# EAGLE design H1AR10 (EAGLE 9.5.1)

## Sheet 1 of 2
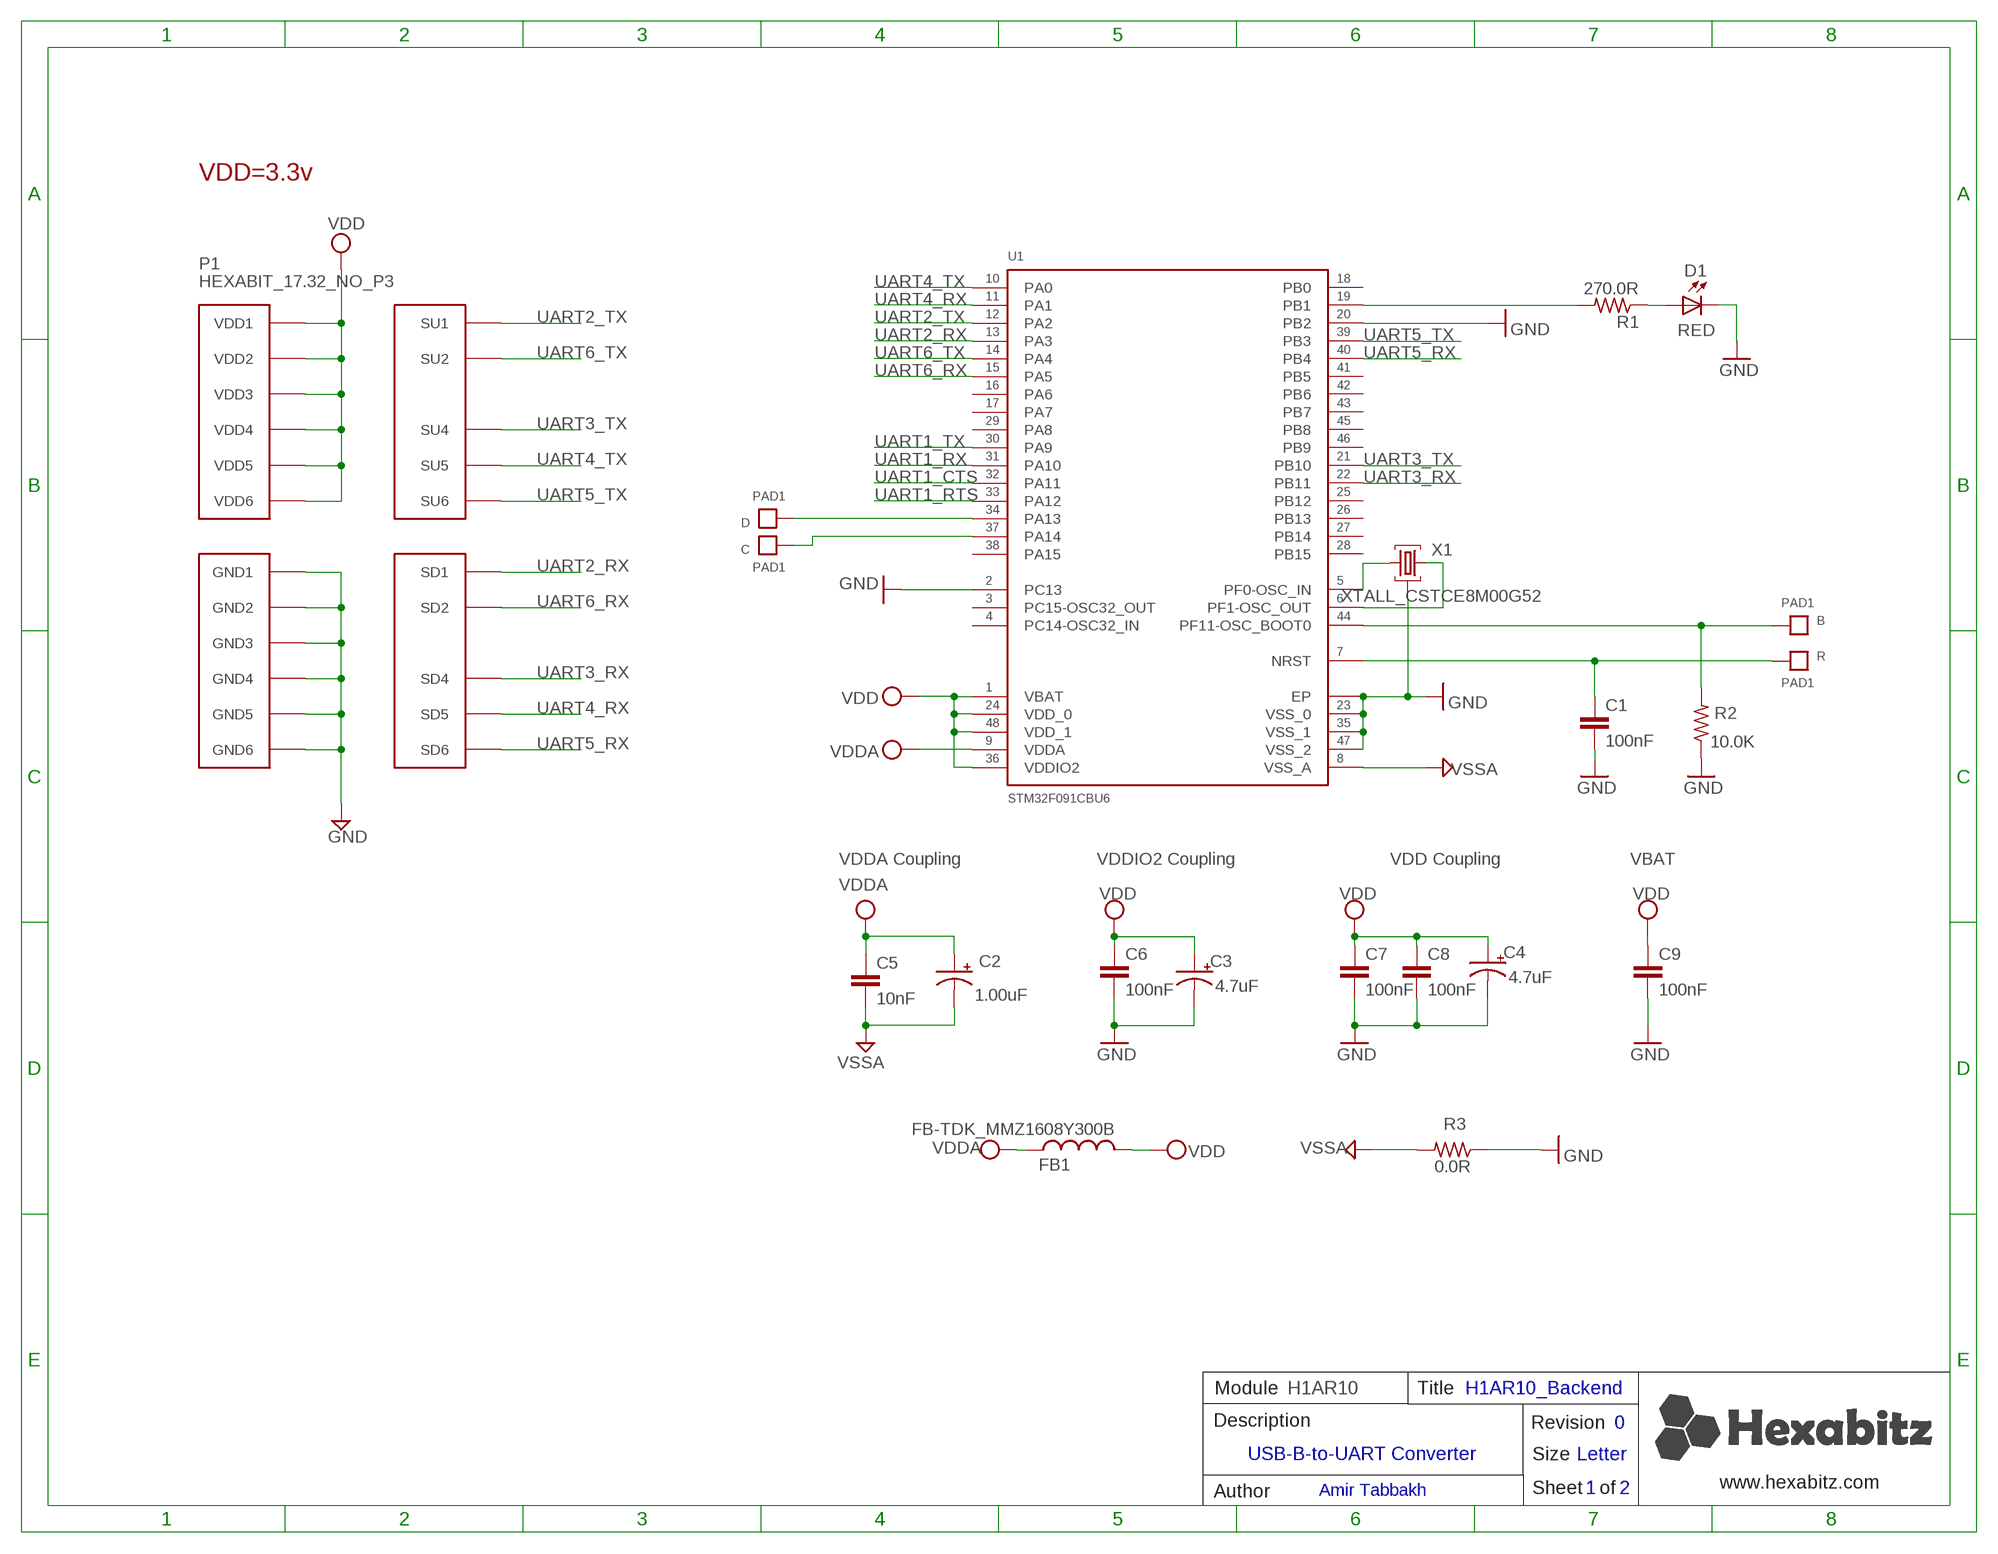
[diagram p0: schematic, sheet 1]

### Parts
B  PAD1  [PAD1]
C  PAD1  [PAD1]
C1  100nF  C-0603  [C-0603]
C2  1.00uF  C-0805-POL  [C-0805-POL]
C3  4.7uF  C-0805-POL  [C-0805-POL]
C4  4.7uF  C-0805-POL  [C-0805-POL]
C5  10nF  C-0603  [C-0603]
C6  100nF  C-0603  [C-0603]
C7  100nF  C-0603  [C-0603]
C8  100nF  C-0603  [C-0603]
C9  100nF  C-0603  [C-0603]
D  PAD1  [PAD1]
D1  RED  VLMS1300-GS08  [VLMS1300-GS08]
FB1  FB-TDK_MMZ1608Y300B  [FB-TDK_MMZ1608Y300B]
P1  HEXABIT_17.32_NO_P3  [HEXABIT_17.32_NO_P3]
R  PAD1  [PAD1]
R1  270.0R  R-0603  [R-0603]
R2  10.0K  R-0603  [R-0603]
R3  0.0R  R-0603  [R-0603]
U1  STM32F091CBU6  [STM32F091CBU6]
X1  XTALL_CSTCE8M00G52  [XTALL_CSTCE8M00G52]

### Nets
B1: B.P$1 B.P$2 R2.2 U1.P$44(PF11-OSC_BOOT0)
GND: C1.2 C3.2(-) C4.2(-) C6.2 C7.2 C8.2 C9.2 D1.C P1.PAD_PD7(GND1) P1.PAD_PD8(GND2) P1.PAD_PD9(GND3) P1.PAD_PD10(GND4) P1.PAD_PD11(GND5) P1.PAD_PD12(GND6) R2.1 R3.1 U1.EP U1.P$2(PC13) U1.P$20(PB2) U1.P$23(VSS_0) U1.P$35(VSS_1) U1.P$47(VSS_2) X1.P$2 ; also sheet 2
N$5: U1.P$5(PF0-OSC_IN) X1.P$1
N$6: U1.P$6(PF1-OSC_OUT) X1.P$3
N$7: D.P$1 D.P$2 U1.P$34(PA13)
N$9: C.P$1 C.P$2 U1.P$37(PA14)
N$18: D1.A R1.1
N$19: R1.2 U1.P$19(PB1)
R1: C1.1 R.P$1 R.P$2 U1.P$7(NRST)
UART1_CTS: U1.P$32(PA11) ; also sheet 2
UART1_RTS: U1.P$33(PA12) ; also sheet 2
UART1_RX: U1.P$31(PA10) ; also sheet 2
UART1_TX: U1.P$30(PA9) ; also sheet 2
UART2_RX: P1.PAD_PD1(SD1) U1.P$13(PA3)
UART2_TX: P1.PAD_PU1(SU1) U1.P$12(PA2)
UART3_RX: P1.PAD_PD4(SD4) U1.P$22(PB11)
UART3_TX: P1.PAD_PU4(SU4) U1.P$21(PB10)
UART4_RX: P1.PAD_PD5(SD5) U1.P$11(PA1)
UART4_TX: P1.PAD_PU5(SU5) U1.P$10(PA0)
UART5_RX: P1.PAD_PD6(SD6) U1.P$40(PB4)
UART5_TX: P1.PAD_PU6(SU6) U1.P$39(PB3)
UART6_RX: P1.PAD_PD2(SD2) U1.P$15(PA5)
UART6_TX: P1.PAD_PU2(SU2) U1.P$14(PA4)
VDD: C3.1(+) C4.1(+) C6.1 C7.1 C8.1 C9.1 FB1.2 P1.PAD_PU7(VDD1) P1.PAD_PU8(VDD2) P1.PAD_PU9(VDD3) P1.PAD_PU10(VDD4) P1.PAD_PU11(VDD5) P1.PAD_PU12(VDD6) U1.P$1(VBAT) U1.P$24(VDD_0) U1.P$36(VDDIO2) U1.P$48(VDD_1) ; also sheet 2
VDDA: C2.1(+) C5.1 FB1.1 U1.P$9(VDDA)
VSSA: C2.2(-) C5.2 R3.2 U1.P$8(VSS_A)
Unconnected: U1.P$3(PC14-OSC32_IN) U1.P$4(PC15-OSC32_OUT) U1.P$16(PA6) U1.P$17(PA7) U1.P$18(PB0) U1.P$25(PB12) U1.P$26(PB13) U1.P$27(PB14) U1.P$28(PB15) U1.P$29(PA8) U1.P$38(PA15) U1.P$41(PB5) U1.P$42(PB6) U1.P$43(PB7) U1.P$45(PB8) U1.P$46(PB9)

### Notes on the sheet
- VDD=3.3v
- VDDA Coupling | VDDIO2 Coupling | VDD Coupling | VBAT
- Module | H1AR10 | Title | H1AR10_Backend
- Description | Revision | 0
- USB-B-to-UART Converter
- Size | Letter
- www.hexabitz.com
- Author | Amir Tabbakh | Sheet   of | 1 | 2
- C:/Users/Admin/Desktop/logodraft.bmp

## Sheet 2 of 2
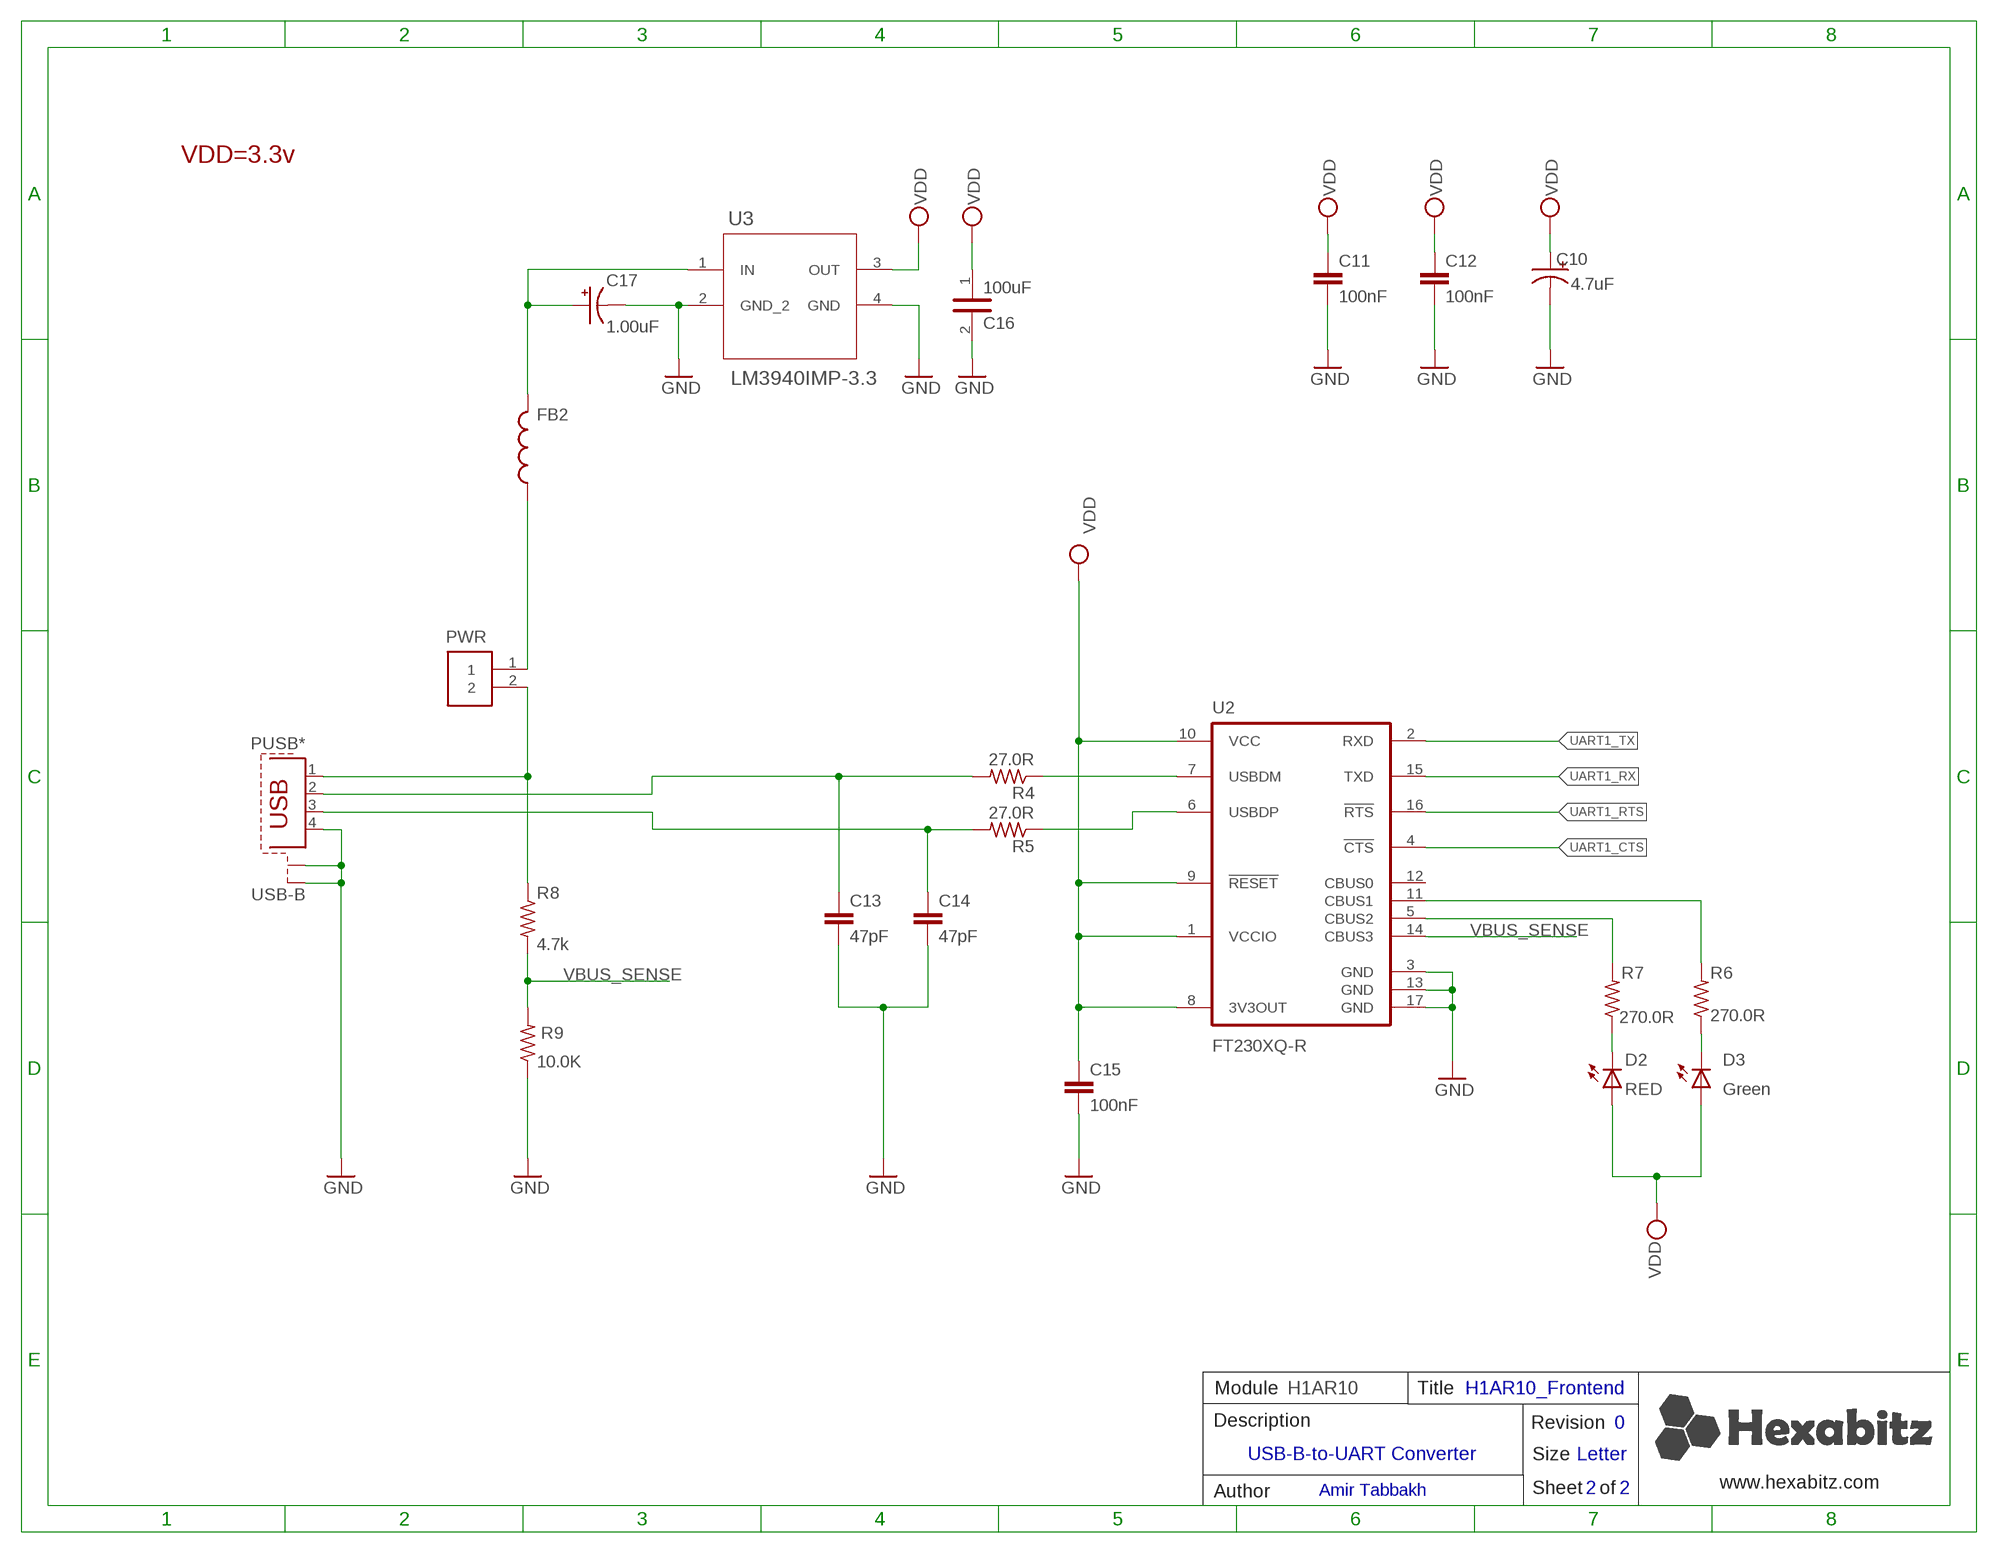
[diagram p1: schematic, sheet 2]

### Parts
C10  4.7uF  C-0805-POL  [C-0805-POL]
C11  100nF  C-0603  [C-0603]
C12  100nF  C-0603  [C-0603]
C13  47pF  C-0603  [C-0603]
C14  47pF  C-0603  [C-0603]
C15  100nF  C-0603  [C-0603]
C16  100uF  C-3225TDK_C3225X5R0J107M250AC_0_0  [C-3225]
C17  1.00uF  C-0805-POL  [C-0805-POL]
D2  RED  VLMS1300-GS08  [VLMS1300-GS08]
D3  Green  VLMS1300-GS08  [VLMS1300-GS08]
FB2  FB-TDK_MMZ1608Y300B  [FB-TDK_MMZ1608Y300B]
PUSB*  USB-B  PN61729-S  [PN61729-S]
PWR  3-644456-2  [TE_3-644456-2]
R4  27.0R  R-0603  [R-0603]
R5  27.0R  R-0603  [R-0603]
R6  270.0R  R-0603  [R-0603]
R7  270.0R  R-0603  [R-0603]
R8  4.7k  R-0603  [R-0603]
R9  10.0K  R-0603  [R-0603]
U2  FT230XQ-R  [QFN16]
U3  LM3940IMP-3.3  [SOT230P696X180-4N]

### Nets
GND: C10.2(-) C11.2 C12.2 C13.2 C14.2 C15.2 C16.2 C17.2(-) PUSB*.4 PUSB*.S1 PUSB*.S2 R9.1 U2.3(GND) U2.13(GND) U2.17(GND) U3.2(GND_2) U3.4(GND) ; also sheet 1
N$2: D3.C R6.1
N$3: R7.2 U2.5(CBUS2)
N$8: D2.C R7.1
N$10: R6.2 U2.11(CBUS1)
N$11: R4.1 U2.7(USBDM)
N$12: R5.1 U2.6(USBDP)
N$13: C14.1 PUSB*.3 R5.2
N$14: C13.1 PUSB*.2 R4.2
N$15: FB2.1 PWR.1
N$16: C17.1(+) FB2.2 U3.1(IN)
N$17: PUSB*.1 PWR.2 R8.1
UART1_CTS: U2.4(!CTS!) ; also sheet 1
UART1_RTS: U2.16(!RTS!) ; also sheet 1
UART1_RX: U2.15(TXD) ; also sheet 1
UART1_TX: U2.2(RXD) ; also sheet 1
VBUS_SENSE: R8.2 R9.2 U2.14(CBUS3)
VDD: C10.1(+) C11.1 C12.1 C15.1 C16.1 D2.A D3.A U2.1(VCCIO) U2.8(3V3OUT) U2.9(!RESET!) U2.10(VCC) U3.3(OUT) ; also sheet 1
Unconnected: U2.12(CBUS0)

### Notes on the sheet
- VDD=3.3v
- Module | H1AR10 | Title | H1AR10_Frontend
- Description | Revision | 0
- USB-B-to-UART Converter
- Size | Letter
- www.hexabitz.com
- Author | Amir Tabbakh | Sheet   of | 2 | 2

## Library data of the parts
B C D R = Hexabitz:PAD1
C1 = Hexabitz:C-0603: CAP CER 10% X7R 0603; CAPACITANCE: 100nF; MFN: AVX; MPN: 0603YC104K4T2A; OCTOPART_URL: https://octopart.com/c0603c104k8ractu-kemet-145075?r=sp&s=9bS9ASSwSEqMCE9KBEQZ0g; TOLERANCE: 10%; VOLTAGE_RATING: 16V
C2 C17 = Hexabitz:C-0805-POL: Cap Tant Solid SMD 2012; CAPACITANCE: 1.00uF; MFN: AVX; MPN: TAJR105M016RNJ; OCTOPART_URL: https://octopart.com/tajr105m016rnj-avx-1188552; TOLERANCE: 20%; VOLTAGE_RATING: 16V
C3 C4 C10 = Hexabitz:C-0805-POL: Cap Tant Solid SMD 2012; CAPACITANCE: 4.7uF; MFN: Panasonic; MPN: 10TPU4R7MSI; OCTOPART_URL: https://octopart.com/10tpu4r7msi-panasonic-29487748; TOLERANCE: 20%; VOLTAGE_RATING: 10V
C5 = Hexabitz:C-0603: CAP CER 10% X7R 0603; CAPACITANCE: 10nF; MFN: AVX; MPN: 0603YC103KAT4A; OCTOPART_URL: https://octopart.com/0603yc103kat4a-avx-2550362; TOLERANCE: 10%; VOLTAGE_RATING: 16V
C6-C9 C11 C12 C15 = Hexabitz:C-0603: CAP CER 10% X7R 0603; CAPACITANCE: 100nF; MFN: AVX; MPN: 0603YC104K4T2A; OCTOPART_URL: https://octopart.com/0603yc104k4t2a-avx-8120651#; TOLERANCE: 10%; VOLTAGE_RATING: 16V
C13 C14 = Hexabitz:C-0603: CAP CER 10% X7R 0603; CAPACITANCE: 47pf; MFN: 06035A470JAT2Aa; MPN: AVX; OCTOPART_URL: https://octopart.com/06035a470jat2a-avx-46507018#; TOLERANCE: 5%; VOLTAGE_RATING: 50
C16 = Hexabitz:C-3225: 100µF ±20% 6.3V Ceramic Capacitor X5R 1210 (3225 Metric); CAPACITANCE: 100.0µF; DESCRIPTION: CAP CER 100UF 6.3V X5R 1210; MFN: TDK; MPN: C3225X5R0J107M250AC; OCTOPART_URL: https://octopart.com/c3225x5r0j107m250ac-tdk-25947844; PACKAGE: 1210 (3225 metric); TEMPERATURE_RANGE_HIGH: +85°C; TEMPERATURE_RANGE_LOW: -55°C; TOLERANCE: 20%; VOLTAGE: 6.3V
D1 D2 = Hexabitz:VLMS1300-GS08: Red 0603 130° Clear 54 mcd 2 V Surface Mount ChipLED ; Octopart Url : http://octopart.com/vlms1300-gs08-vishay-21709201; MFN: Vishay; MPN: VLMS1300-GS08; OCTOPART_URL: https://octopart.com/vlms1300-gs08-vishay-21709201
D3 = Hexabitz:VLMS1300-GS08: Red 0603 130° Clear 54 mcd 2 V Surface Mount ChipLED ; Octopart Url : http://octopart.com/vlms1300-gs08-vishay-21709201; MFN: Vishay; MPN: VLMTG1300-GS08; OCTOPART_URL: https://octopart.com/vlmtg1300-gs08-vishay-21709202; VALUE: RED
FB1 FB2 = Hexabitz:FB-TDK_MMZ1608Y300B: Ferrite Beads Multi-Layer 30Ohm 25% 100MHz 1.5A 50mOhm DCR 0603; MFN: TDK; MPN: MMZ1608Y300B; OCTOPART_URL: https://octopart.com/mmz1608y300b-tdk-368280?r=sp&s=cd9_2ZEqQ9q9UNBuQgHAiA
P1 = hexabitz_connectors:HEXABIT_?_NO_P3: Hexabitz Hexagon Module Connector Hexagon side length = 17.32mm. The following ports are removed: P3
PUSB* = Hexabitz:PN61729-S: BERG USB connector; MFN: ASSMANN WSW Components; MPN: A-USBSB; OCTOPART_URL: https://octopart.com/a-usbsb-assmann+wsw+components-192191#
PWR = Hexabitz:3-644456-2; DESCRIPTION: Connector Unshrouded Header HDR 2 Position 2.54mm Solder Straight Thru-Hole; MFN: TE Connectivity; MPN: 3-644456-2; OCTOPART_URL: http://octopart.com/3-644456-2-te+connectivity+%2F+amp-39514699
R1 R6 R7 = Hexabitz:R-0603: Thick Film Resistors - SMD 0603; MFN: Panasonic; MPN: ERJ-3GEYJ271V; OCTOPART_URL: https://octopart.com/erj-3geyj271v-panasonic-55560546#; RESISTANCE: 270.0 Ohm; TOLERANCE: 5%
R2 R9 = Hexabitz:R-0603: Thick Film Resistors - SMD 0603; MFN: Vishay; MPN: CRCW060310K0JNEB; OCTOPART_URL: https://octopart.com/crcw060310k0jneb-vishay-46603269; RESISTANCE: 10.0K Ohm; TOLERANCE: 5%
R3 = Hexabitz:R-0603: Thick Film Resistors - SMD 0603; MFN: Vishay; MPN: CRCW06030000Z0EAHP; OCTOPART_URL: https://octopart.com/crcw06030000z0eahp-vishay-44320230; RESISTANCE: 0.0 Ohm
R4 R5 = Hexabitz:R-0603: Thick Film Resistors - SMD 0603; MFN: Vishay; MPN: CRCW060327R0FKEA; OCTOPART_URL: https://octopart.com/crcw060327r0fkea-vishay-39833156; RESISTANCE: 270.0 Ohm; TOLERANCE: 1%
R8 = Hexabitz:R-0603: Thick Film Resistors - SMD 0603; MFN: Vishay; MPN: CRCW06034K70FKEA; OCTOPART_URL: https://octopart.com/crcw06034k70fkea-vishay-39455708; RESISTANCE: 4.7 K; TOLERANCE: 1%
U1 = Hexabitz:STM32F091CBU6: Description : ARM-based 32-bit MCU, CAN, 12 timers, ADC, DAC & Comm. Interface, 2 to 3.6 V, -40 to 85 degC, 48-Pin UFQFPN, RoHS, Tray ;Parameter : Ciiva URL : https://ciiva.com/part/STM32F091CBU6-20240708, CiivaID : 20240708, Clock Speed : 48000000.0 Hz, Lifecycle Status : Active, Mounting Style : Surface Mount, Number of Pins : 48, Octopart Url : https://octopart.com/stm32f091cbu6-stmicroelectronics-51988677, OctopartID : 5f4f955c32ec8088, RAM Memory Size : 32768 B, REACH SVHC Compliance : No SVHC, RoHS : Compliant,; MFN: STMicroelectronics; MPN: STM32F091CBU6; OCTOPART_URL: https://octopart.com/stm32f091cbu6-stmicroelectronics-51988677?r=sp&s=bU6fpgsrTZOxHyt7jkfh3w
U2 = Hexabitz:FT230XQ-R: USB to BASIC UART; DESCRIPTION: USB Bridge, USB to UART USB 2.0 UART Interface 16-QFN _4x4_; MFN: FTDI,; MPN: FT230XQ-R; OCTOPART_URL: https://octopart.com/ft230xq-r-ftdi-22061504?r=sp; PACKAGE: QFN-16 FTDI
U3 = Hexabitz:LM3940IMP-3.3: Low Dropout Regulator; DESCRIPTION: Linear Voltage Regulator IC 1 Output 1A SOT-223-4; MFN: Texas Instruments; MPN: LM3940IMP-3.3/NOPB; OCTOPART_URL: https://octopart.com/lm3940imp-3.3%2Fnopb-texas+instruments-24823014?r=sp; PACKAGE: SOT-223 Texas Instruments
X1 = Hexabitz:XTALL_CSTCE8M00G52: MURATA CSTCE8M00G52-R0 RESONATOR, SMD, 8MHZ ; Octopart Url : https://octopart.com/cstce8m00g52-r0-murata-7145559; MFN: Murata; MPN: CSTCE8M00G52Z-R0; OCTOPART_URL: https://octopart.com/cstce8m00g52z-r0-murata-17755941?r=sp&s=JDnNJnrHQhyS8Zk4ofFWXw

## Board
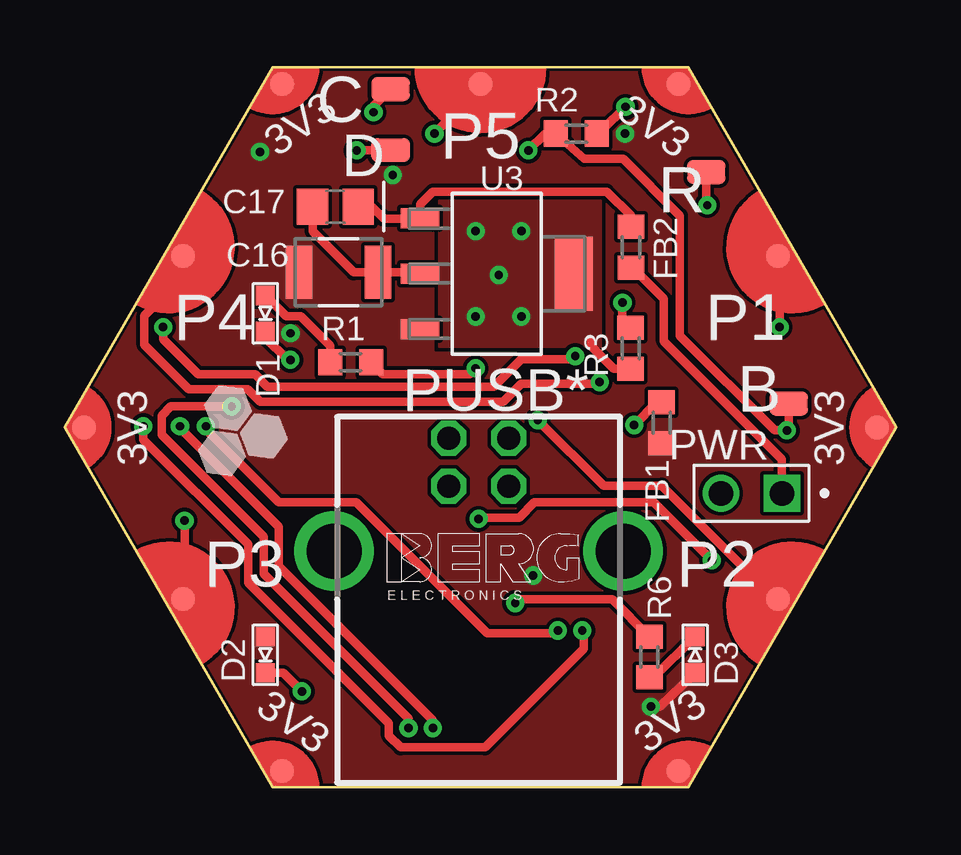
[diagram p2: board, top side]
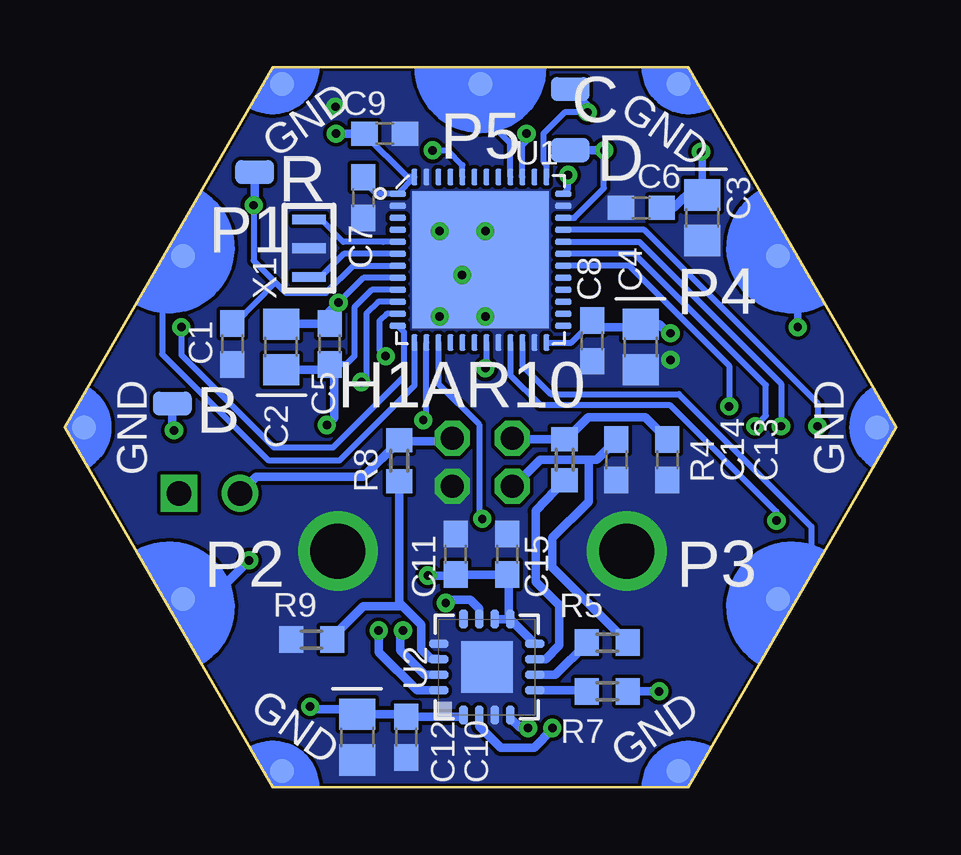
[diagram p3: board, bottom side, seen from below]

Size 34.64 x 30 mm. Coordinates in mm from the lower left corner, seen from the top.
Copper layers (1*16): Top 0.035mm / dielectric 1.5mm / Bottom 0.035mm
Design rules "2_layer *": minimum track width 7mil, minimum drill 10mil, track to track 6mil, track to pad 6mil, pad to pad 6mil, via to via 6mil, smd to smd 0mil, copper to edge 1mil, drill to drill 8mil, minimum pad ring 10mil, minimum via ring 8mil, stop-mask expansion 2mil, vias tented up to drill 15mil, thermal gap 10mil

### Footprints (pad centres in the part's own frame; a part is rotated, then mirrored left to right if it is on the bottom)
PAD1 = smd 1.6 x 1: P$1 0,0 | smd 1.6 x 1 bottom: P$2 0,0
C-0603 = smd 1.1 x 1: 1 -0.85,0; 2 0.85,0
C-0805-POL = smd 1.3 x 1.5: 1 -0.95,0; 2 0.95,0
C-3225 = smd 1.1 x 2.2: 1 -1.65,0; 2 1.65,0
VLMS1300-GS08 = smd 0.8 x 0.8: A 0,0.75; C 0,-0.75
FB-TDK_MMZ1608Y300B = smd 1 x 1.1: 1 -0.85,0; 2 0.85,0
HEXABIT_17.32_NO_P3 = smd 1 x 1 bottom: PAD_PD1 12.39,7.15; PAD_PD2 12.39,-7.15; PAD_PD4 -12.39,-7.15; PAD_PD5 -12.39,7.15; PAD_PD6 0,14.31; PAD_PD7 8.26,14.31; PAD_PD8 16.52,0; PAD_PD9 8.26,-14.31; PAD_PD10 -8.26,-14.31; PAD_PD11 -16.52,0; PAD_PD12 -8.26,14.31 | smd 1 x 1: PAD_PU1 12.39,7.15; PAD_PU2 12.39,-7.15; PAD_PU4 -12.39,-7.15; PAD_PU5 -12.39,7.15; PAD_PU6 0,14.31; PAD_PU7 8.26,14.31; PAD_PU8 16.52,0; PAD_PU9 8.26,-14.31; PAD_PU10 -8.26,-14.31; PAD_PU11 -16.52,0; PAD_PU12 -8.26,14.31
PN61729-S = drill 0.95 octagon: 1 1.25,4.71; 2 -1.25,4.71; 3 -1.25,2.71; 4 1.25,2.71 | drill 2.3 pad 2.9: S1 -6.02,0; S2 6.02,0
TE_3-644456-2 = drill 1.02 pad 1.37 square: 1 0,0 | drill 1.02 pad 1.37: 2 2.54,0
R-0603 = smd 1 x 1.1: 1 -0.85,0; 2 0.85,0
STM32F091CBU6 = smd 5.7 x 5.7: EP 0,0 | smd 0.25 x 0.7: P$1 -2.75,-3.45; P$2 -2.25,-3.45; P$3 -1.75,-3.45; P$4 -1.25,-3.45; P$5 -0.75,-3.45; P$6 -0.25,-3.45; P$7 0.25,-3.45; P$8 0.75,-3.45; P$9 1.25,-3.45; P$10 1.75,-3.45; P$11 2.25,-3.45; P$12 2.75,-3.45; P$25 2.75,3.45; P$26 2.25,3.45; P$27 1.75,3.45; P$28 1.25,3.45; P$29 0.75,3.45; P$30 0.25,3.45; P$31 -0.25,3.45; P$32 -0.75,3.45; P$33 -1.25,3.45; P$34 -1.75,3.45; P$35 -2.25,3.45; P$36 -2.75,3.45 | smd 0.7 x 0.25: P$13 3.45,-2.75; P$14 3.45,-2.25; P$15 3.45,-1.75; P$16 3.45,-1.25; P$17 3.45,-0.75; P$18 3.45,-0.25; P$19 3.45,0.25; P$20 3.45,0.75; P$21 3.45,1.25; P$22 3.45,1.75; P$23 3.45,2.25; P$24 3.45,2.75; P$37 -3.45,2.75; P$38 -3.45,2.25; P$39 -3.45,1.75; P$40 -3.45,1.25; P$41 -3.45,0.75; P$42 -3.45,0.25; P$43 -3.45,-0.25; P$44 -3.45,-0.75; P$45 -3.45,-1.25; P$46 -3.45,-1.75; P$47 -3.45,-2.25; P$48 -3.45,-2.75
QFN16 = smd 0.8 x 0.35: 1 -2,0.975; 2 -2,0.325; 3 -2,-0.325; 4 -2,-0.975; 9 2,-0.975; 10 2,-0.325; 11 2,0.325; 12 2,0.975 | smd 0.35 x 0.8: 5 -0.975,-2; 6 -0.325,-2; 7 0.325,-2; 8 0.975,-2; 13 0.975,2; 14 0.325,2; 15 -0.325,2; 16 -0.975,2 | smd 2.15 x 2.15: 17 0,0
SOT230P696X180-4N = smd 1.6 x 0.838: 1 -3.2,2.311; 2 -3.2,0; 3 -3.2,-2.311 | smd 1.6 x 3.099: 4 3.2,0
XTALL_CSTCE8M00G52 = smd 1.4 x 0.4: P$1 0,1.2; P$2 0,0; P$3 0,-1.2

### Placement (x,y rotation side)
B  30.16,15.99 180 top
C  13.58,29.1 180 top
C1  27.66,18.48 270 bottom
C2  25.63,18.35 90 bottom
C3  8.08,23.74 270 bottom
C4  10.64,18.35 270 bottom
C5  23.59,18.48 90 bottom
C6  10.62,24.14 180 bottom
C7  22.2,24.58 270 bottom
C8  12.67,18.61 270 bottom
C9  21.31,27.24 0 bottom
C10  22.45,2.1 270 bottom
C11  18.36,9.72 90 bottom
C12  20.42,2.1 270 bottom
C13  9.53,13.65 270 bottom
C14  11.66,13.65 270 bottom
C15  16.2,9.72 90 bottom
C16  11.4,21.46 0 top
C17  11.27,24.19 180 top
D  13.57,26.56 0 bottom
D1  8.35,19.75 0 top
D2  8.35,5.53 0 top
D3  26.26,5.53 180 top
FB1  24.87,15.19 270 top
FB2  23.59,22.51 90 top
P1  17.32,15 0 top
PUSB*  17.24,9.84 0 top
PWR  29.88,12.26 180 top
R  26.73,25.63 180 top
R1  11.91,17.72 0 top
R2  21.31,27.24 180 top
R3  23.58,18.3 90 top
R4  13.81,13.65 90 bottom
R5  12.04,6.03 0 bottom
R6  24.36,5.44 90 top
R7  12.04,4 180 bottom
R8  20.7,13.61 270 bottom
R9  24.36,6.16 0 bottom
U1  17.32,21.99 270 bottom
U2  17.05,5.02 90 bottom
U3  18.01,21.4 0 top
X1  24.47,22.47 0 bottom

### Tracks (layer width: path | path; a pad name or v marks a point on that pad's centre or on a via)
B1  (via drill 0.35)
  Top 0.356: B.P$1 30.16,14.95 v30.09,14.88 29.58,14.88 25.63,18.83 25.63,23.83 23.26,26.19 21.64,26.19 R2.2 20.01,27.24 v19.31,26.54
  Bottom 0.254: v19.31,26.54 18.68,26.54 18.07,25.93 U1.P$44
  Bottom 0.356: B.P$1 30.16,14.95 v30.09,14.88
GND  (via drill 0.35)
  Top 0.254: 18.08,21.4 v18.08,21.35
  Top 0.356: v23.36,28.36 22.38,27.38 R2.1 | R3.1 22.87,17.45 21.94,18.38 21.94,18.61 | U3.2 14.74,21.46 C16.2 12.04,21.46 10.32,23.18 C17.2 | D1.C 8.35,18.75 9.28,17.81 v9.4,17.81
  other vias: 19.02,23.18 17.12,23.18 19.02,19.62 17.12,19.62
  pour Bottom (isolate 0.102, no thermals): 8.66,0 25.98,0 34.64,15 25.98,30 8.66,30 0,15
  pour Top (isolate 0.102, no thermals): 15.59,24.45 22.32,24.45 22.32,18.35 15.59,18.35
N$2
  Top 0.305: 24.51,4.59 R6.1
  Top 0.356: D3.C 24.51,4.59
N$3
  Bottom 0.356: U2.5 12.93,4.04 R7.2
N$5
  Bottom 0.254: U1.P$5 21.37,22.73 23.03,22.73 23.96,23.67 X1.P$1
N$6
  Bottom 0.254: X1.P$3 23.99,21.27 23.02,22.23 U1.P$6
N$7  (via drill 0.35)
  Top 0.356: D.P$1 13.57,26.54 v12.16,26.54
  Bottom 0.254: U1.P$34 13.41,23.73 12.18,24.97 12.18,26.56
  Bottom 0.356: D.P$1 12.18,26.56 v12.16,26.54
N$8  (via drill 0.35)
  Top 0.356: D2.C 9.1,4.78 v9.88,4
  Bottom 0.356: v9.88,4 R7.1
N$9  (via drill 0.35)
  Top 0.356: v12.86,28.13 12.86,28.38 C.P$1
  Bottom 0.254: v12.86,28.13 13.81,28.13 14.7,27.24 14.7,26.08 14.57,25.94 U1.P$37
  Bottom 0.356: C.P$1 12.86,28.38 v12.86,28.13
N$10  (via drill 0.35)
  Top 0.356: R6.2 22.81,7.84 18.92,7.84 v18.77,7.68
  Bottom 0.305: 18.64,7.81 v18.77,7.68
  Bottom 0.356: 18.64,7.81 17.75,7.81 17.38,7.44 U2.11
N$11
  Bottom 0.356: R4.1 15.02,11.53 15.02,8.57 14.03,7.58 14.03,5.91 14.6,5.34 U2.7
N$12
  Bottom 0.356: U2.6 14.2,4.69 12.88,6.02 R5.1
N$13
  Bottom 0.356: C14.1 11.66,14.46 12.47,13.65 12.81,13.65 | R5.2 14.32,9.18 14.32,10.4 12.81,11.91 12.81,13.65 | PUSB*.3 15.99,12.53 15.97,12.51 14.84,13.65 12.81,13.65
N$14
  Bottom 0.356: C13.1 10.46,15.43 12.82,15.43 13.76,14.49 R4.2 15.94,14.5 PUSB*.2
N$15
  Top 0.356: PWR.1 29.88,13.68 24.97,18.6 24.97,20.36 23.66,21.66 FB2.1
N$16
  Top 0.356: FB2.2 23.59,23.81 22.58,24.83 15.34,24.83 14.81,24.3 U3.1 14.78,23.69 13.31,23.69 12.8,24.19 C17.1
N$17
  Bottom 0.356: PWR.2 26.66,12.94 22.2,12.94 20.7,14.43 R8.1 20.67,14.43 18.62,14.43 PUSB*.1
N$18
  Top 0.356: D1.A 9.22,19.63 9.82,19.63 11.06,18.39 R1.1
N$19  (via drill 0.35)
  Top 0.356: v17.12,17.46 16.87,17.22 13.26,17.22 R1.2
  Bottom 0.254: U1.P$19 17.07,17.51
  Bottom 0.356: 17.07,17.51 v17.12,17.46
R1  (via drill 0.35)
  Top 0.356: v26.77,24.26 26.73,24.3 R.P$1
  Bottom 0.254: 25.86,21.04 26.77,21.94 v26.77,24.26 | 25.86,21.04 25.43,20.61 23.76,20.61 22.63,21.73 U1.P$7 | C1.1 27.53,19.33 25.86,21.04
  Bottom 0.356: R.P$1 26.73,24.3 v26.77,24.26
UART1_CTS  (via drill 0.35)
  Top 0.356: v15.34,2.48 15.34,2.81 8.93,9.22 8.93,10.86 4.8,14.99 v4.8,15.05
  Bottom 0.254: v4.8,15.05 4.8,16.83 8.93,20.96 10.7,22.73 U1.P$32
  Bottom 0.305: U2.4 16.08,2.89
  Bottom 0.356: v15.34,2.48 15.67,2.48 16.08,2.89
UART1_RTS  (via drill 0.35)
  Top 0.356: v21.56,6.54 21.62,6.48 21.62,5.78 17.51,1.67 13.99,1.67 13.5,2.15 13.5,2.67 7.64,8.54 7.64,10.13 3.27,14.49 v3.27,15.05
  Bottom 0.254: v3.27,15.05 3.27,16.01 10.49,23.23 U1.P$33
  Bottom 0.356: v21.56,6.54 21.56,5.64 19.96,4.04 U2.16
UART1_RX  (via drill 0.35)
  Top 0.356: v5.88,15.05 5.88,14.92 8.93,11.88 12.15,11.88 17.6,6.43 20.43,6.43 v20.55,6.54
  Bottom 0.254: v5.88,15.05 5.43,15.49 5.43,16.76 10.93,22.26 13.85,22.26 U1.P$31
  Bottom 0.356: v20.55,6.54 20.67,6.41 20.67,5.72 19.65,4.69 U2.15
UART1_TX  (via drill 0.35)
  Top 0.356: v6.96,15.88 4.42,15.88 4.04,15.49 4.04,14.69 8.29,10.44 8.29,8.89 14.32,2.86 v14.32,2.48
  Bottom 0.254: v6.96,15.88 6.96,17.57 11.12,21.73 U1.P$30
  Bottom 0.305: 14.32,2.41 v14.32,2.48
  Bottom 0.356: 14.32,2.41 15.08,1.65 16.48,1.65 17.38,2.55 U2.2
UART2_RX
  Bottom 0.254: U1.P$13 20.07,16.74 23.2,13.61 26.14,13.61 30.58,18.06 30.58,21.28 P1.PAD_PD1
UART2_TX  (via drill 0.35)
  Top 0.356: P1.PAD_PU1 29.78,22.07 v29.78,19.18
  Bottom 0.254: U1.P$12 20.52,18.98 20.52,17.11 23.47,14.16 25.92,14.16 29.78,18.02 v29.78,19.18
UART3_RX
  Bottom 0.254: U1.P$22 15.57,17.57 14.39,16.38 9.05,16.38 3.53,10.86 3.53,9.25
  Bottom 0.305: 3.53,9.25 P1.PAD_PD4
UART3_TX  (via drill 0.35)
  Top 0.254: P1.PAD_PU4 4.93,8.96 4.99,9.02
  Top 0.356: v4.99,11.11 4.99,9.02
  Bottom 0.254: U1.P$21 16.07,17.18 14.83,15.94 9.43,15.94 4.99,11.49 v4.99,11.11
UART4_RX  (via drill 0.35)
  Top 0.356: v4.1,19.18 4.1,18.67 5.56,17.21 7.93,17.21 8.44,16.7 17.88,16.7 19.02,17.84 21.14,17.84 v21.27,17.97
  Bottom 0.254: U1.P$11 21.23,19.73 21.53,19.44 21.53,18.23 v21.27,17.97 | 4.1,21.32 P1.PAD_PD5
  Bottom 0.305: 4.1,21.32 v4.1,19.18
UART4_TX  (via drill 0.35)
  Top 0.254: P1.PAD_PU5 4.93,21.27
  Top 0.356: 4.93,21.27 3.31,19.66 3.31,18.44 5.17,16.58 7.63,16.58 8.15,16.07 18.26,16.07 19.02,16.83 22.28,16.83 v22.28,16.89
  Bottom 0.254: U1.P$10 21.58,20.23 22.07,19.75 22.07,17.11 v22.28,16.89
UART5_RX
  Bottom 0.254: U1.P$40 16.07,26.83 17.32,28.08 P1.PAD_PD6
UART5_TX  (via drill 0.35)
  Top 0.356: P1.PAD_PU6 17.32,29.16 v15.4,27.24
  Bottom 0.254: v15.4,27.24 15.4,26.92 15.6,26.73 15.6,25.47 U1.P$39
UART6_RX  (via drill 0.35)
  Top 0.356: v26.96,9.46 24.55,11.88 19.57,11.88 18.93,11.24 17.29,11.24 v17.24,11.19
  Bottom 0.254: U1.P$15 19.07,16.83 17.37,15.13 17.37,11.32 v17.24,11.19
  Bottom 0.305: P1.PAD_PD2 28.57,7.85
  Bottom 0.356: 28.57,7.85 v26.96,9.46
UART6_TX  (via drill 0.35)
  Top 0.305: P1.PAD_PU2 29.6,7.85
  Top 0.356: v19.7,15.3 22.47,12.57 24.88,12.57 29.6,7.85
  Bottom 0.254: U1.P$14 19.57,15.42 19.59,15.42 v19.7,15.3
VBUS_SENSE
  Bottom 0.356: R8.2 20.7,7.7 20.58,7.58 | U2.14 19.07,5.36 19.39,5.36 19.78,5.76 19.78,6.78 20.58,7.58 | 20.58,7.58 20.59,7.56 22.2,7.56 23.51,6.25 R9.2
VDD  (via drill 0.35)
  Top 0.305: 24.79,3.37 v24.42,3.37
  Top 0.356: D3.A 24.79,3.37
  Bottom 0.254: C11.1 18.35,8.78 | 16.14,8.65 C15.1 | C9.1 22.16,27.21 20.38,25.43 U1.P$48 U1.P$1 21.66,24.73 22.2,25.27 C7.1 | U1.P$24 13.53,18.53 12.67,19.39 C8.1 | U1.P$36 13.67,24.94 v13.67,25.52
  Bottom 0.305: v8.13,26.48 8.08,26.43 C3.1 8.4,25 | U2.9 16.14,7.08
  Bottom 0.356: v19.51,8.83 18.39,8.83 C11.1 C15.1 | C6.1 9.26,24.14 8.4,25 | U2.8 U2.9 U2.10 | 16.14,7.08 16.14,8.65 | C9.1 v23.34,27.24 | v9.4,18.92 9.45,18.88 9.88,19.3 C4.1 10.77,19.18 12.39,19.18 C8.1 | v24.42,3.37 24.3,3.25 22.65,3.25 C10.1 20.52,3.05 C12.1 18.1,2.95 U2.1
  pour Top (isolate 0.102, rank 2, no thermals): 8.66,0 25.98,0 34.64,15 25.98,30 8.64,30 -0.01,15.02
VDDA  (via drill 0.35)
  Top 0.356: v23.72,15.1 24.66,16.04 FB1.1
  Bottom 0.254: U1.P$9 21.85,20.73 22.58,20 22.58,17.97 22.92,17.63 C5.1
  Bottom 0.356: v23.72,15.1 23.42,15.4 23.42,17.46 23.48,17.39 23.49,17.4 | C5.1 23.37,17.4 23.49,17.4 | C2.1 23.49,17.4
VSSA  (via drill 0.35)
  Top 0.356: v23.24,20.2 23.24,19.5 R3.2
  Bottom 0.254: v23.24,20.2 22.2,21.23 U1.P$8
  Bottom 0.356: v23.24,20.2 23.64,19.79 C5.2 25.6,19.33 C2.2

### Text on the board
tPlace: 3V3 | P5 | 3V3 | P4 | P1 | 3V3 | 3V3 | P3 | P2 | 3V3 | 3V3
bPlace: GND | P5 | GND | P1 | P4 | H1AR10 | GND | GND | P3 | P2 | GND | GND
tNames: D
bNames: C | R | B